# EAGLE schematic main (EAGLE 5.01)
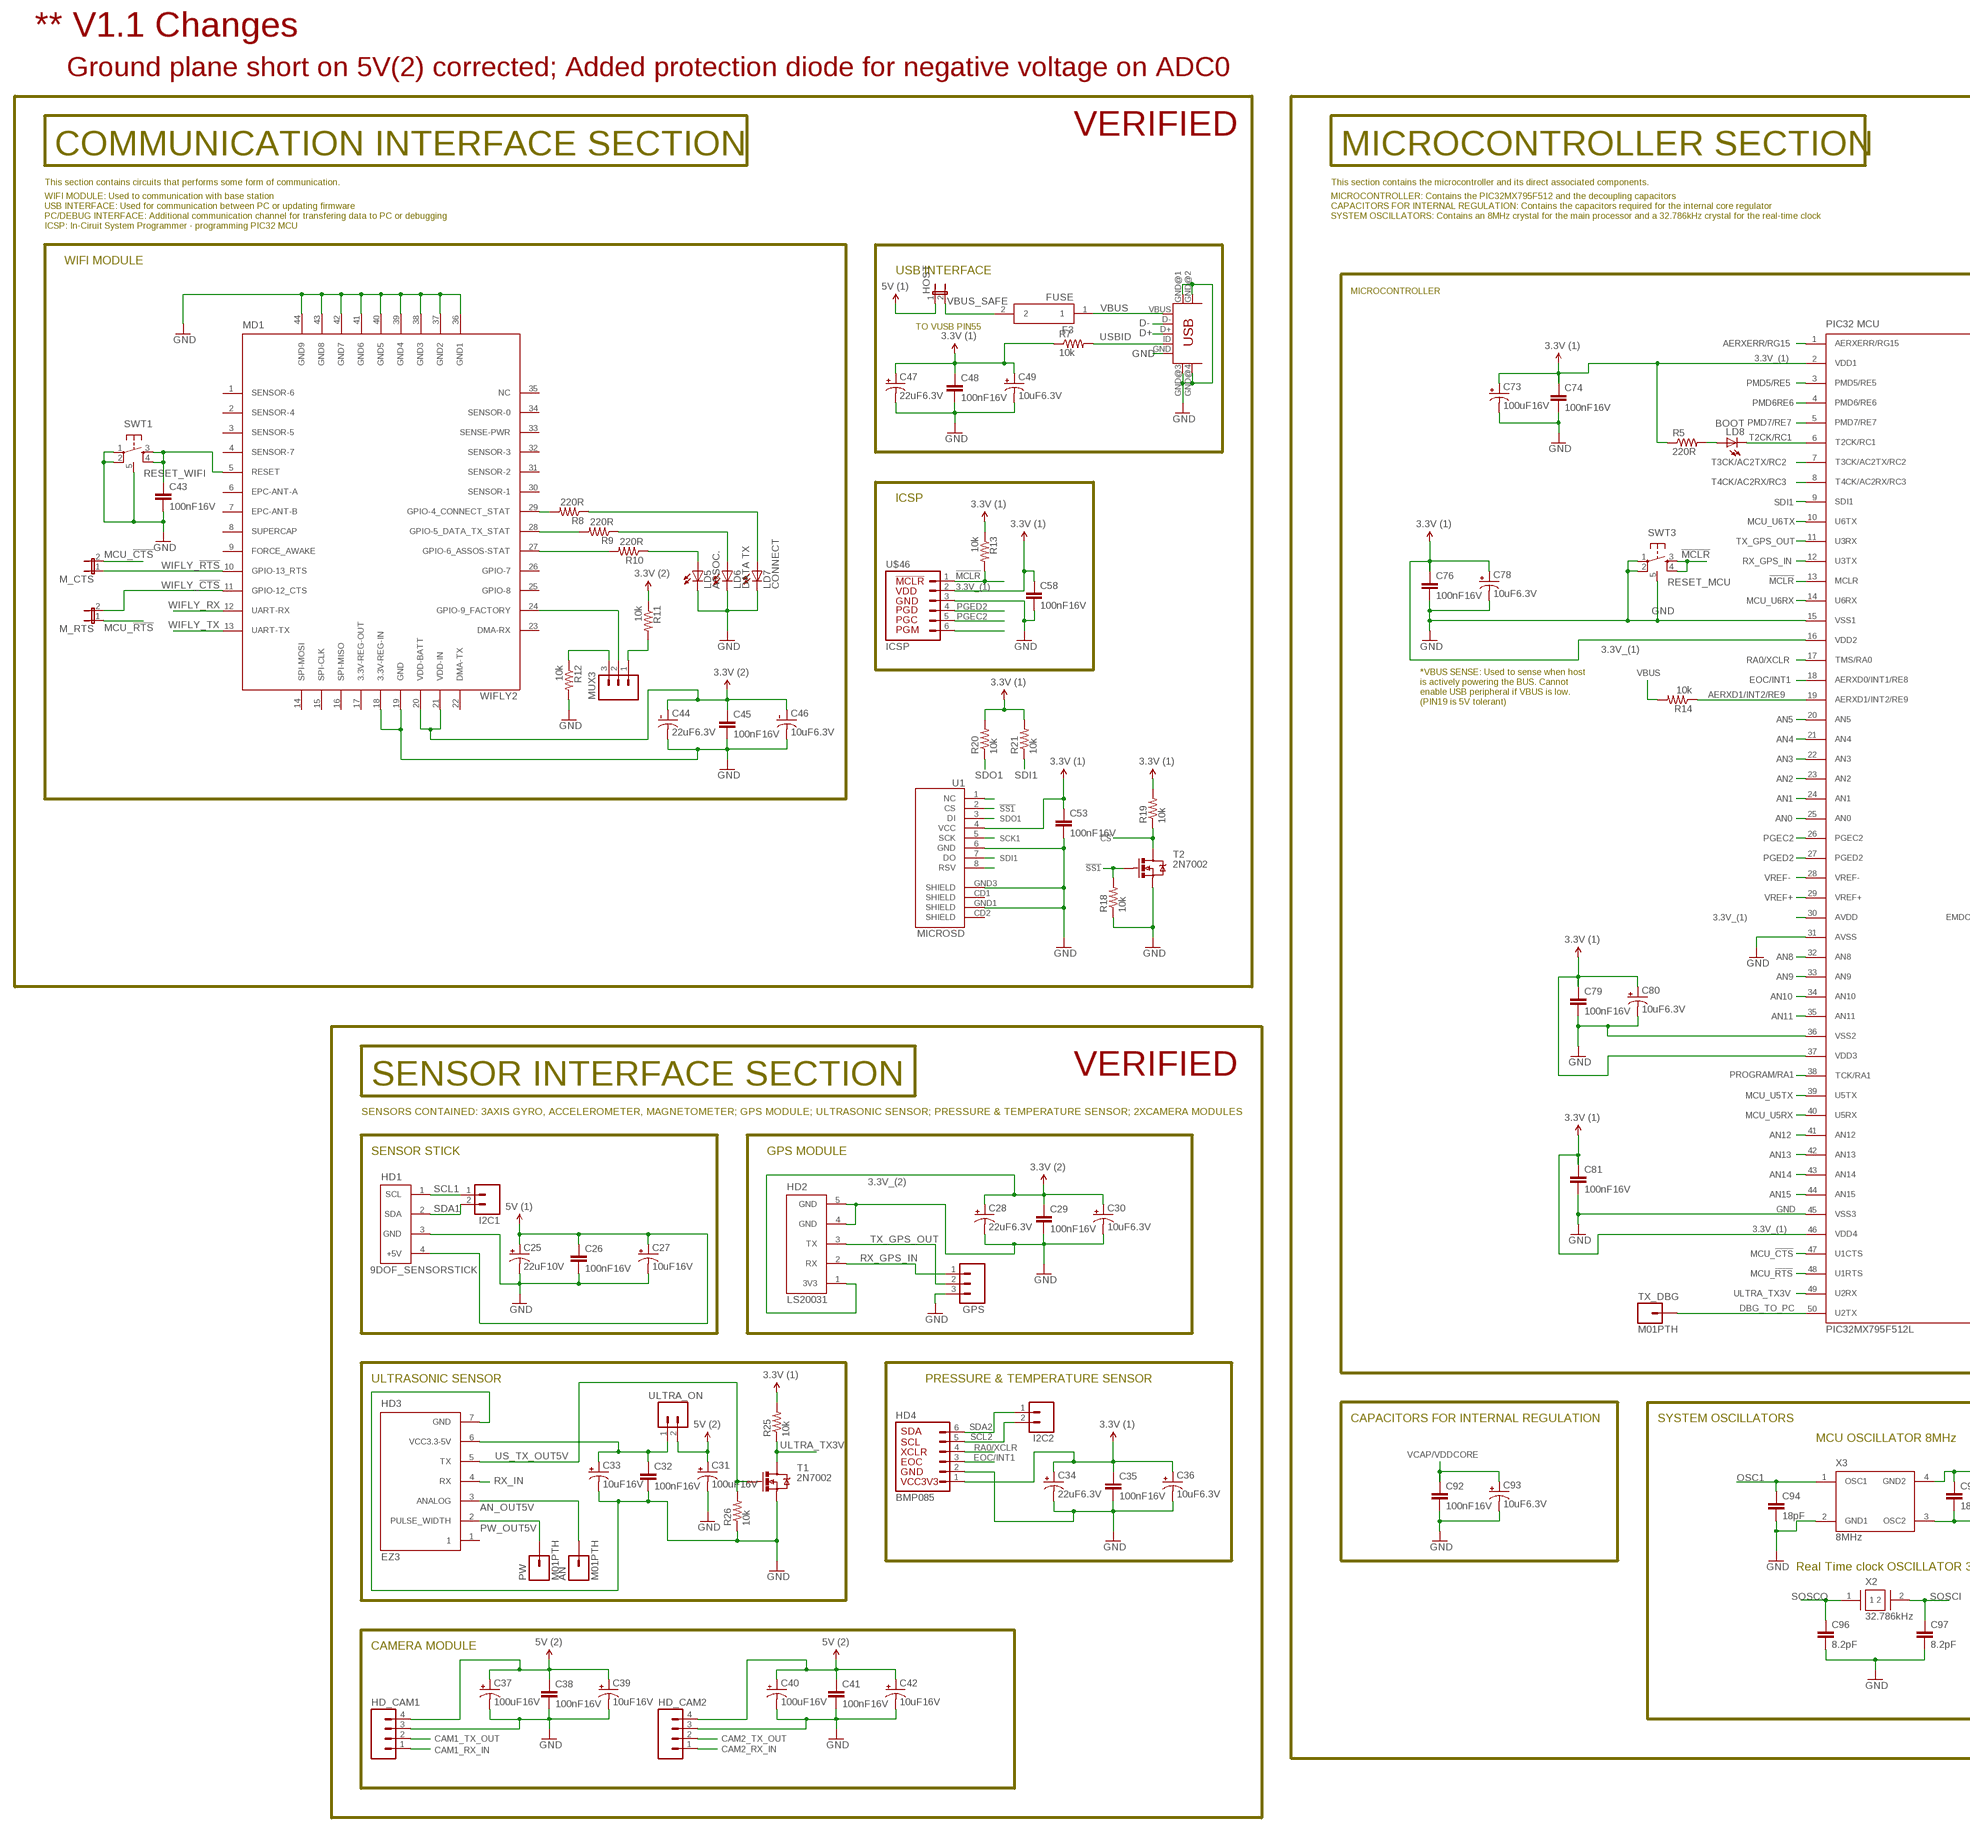
[diagram p0: schematic, sheet 1, part 1 of 2]
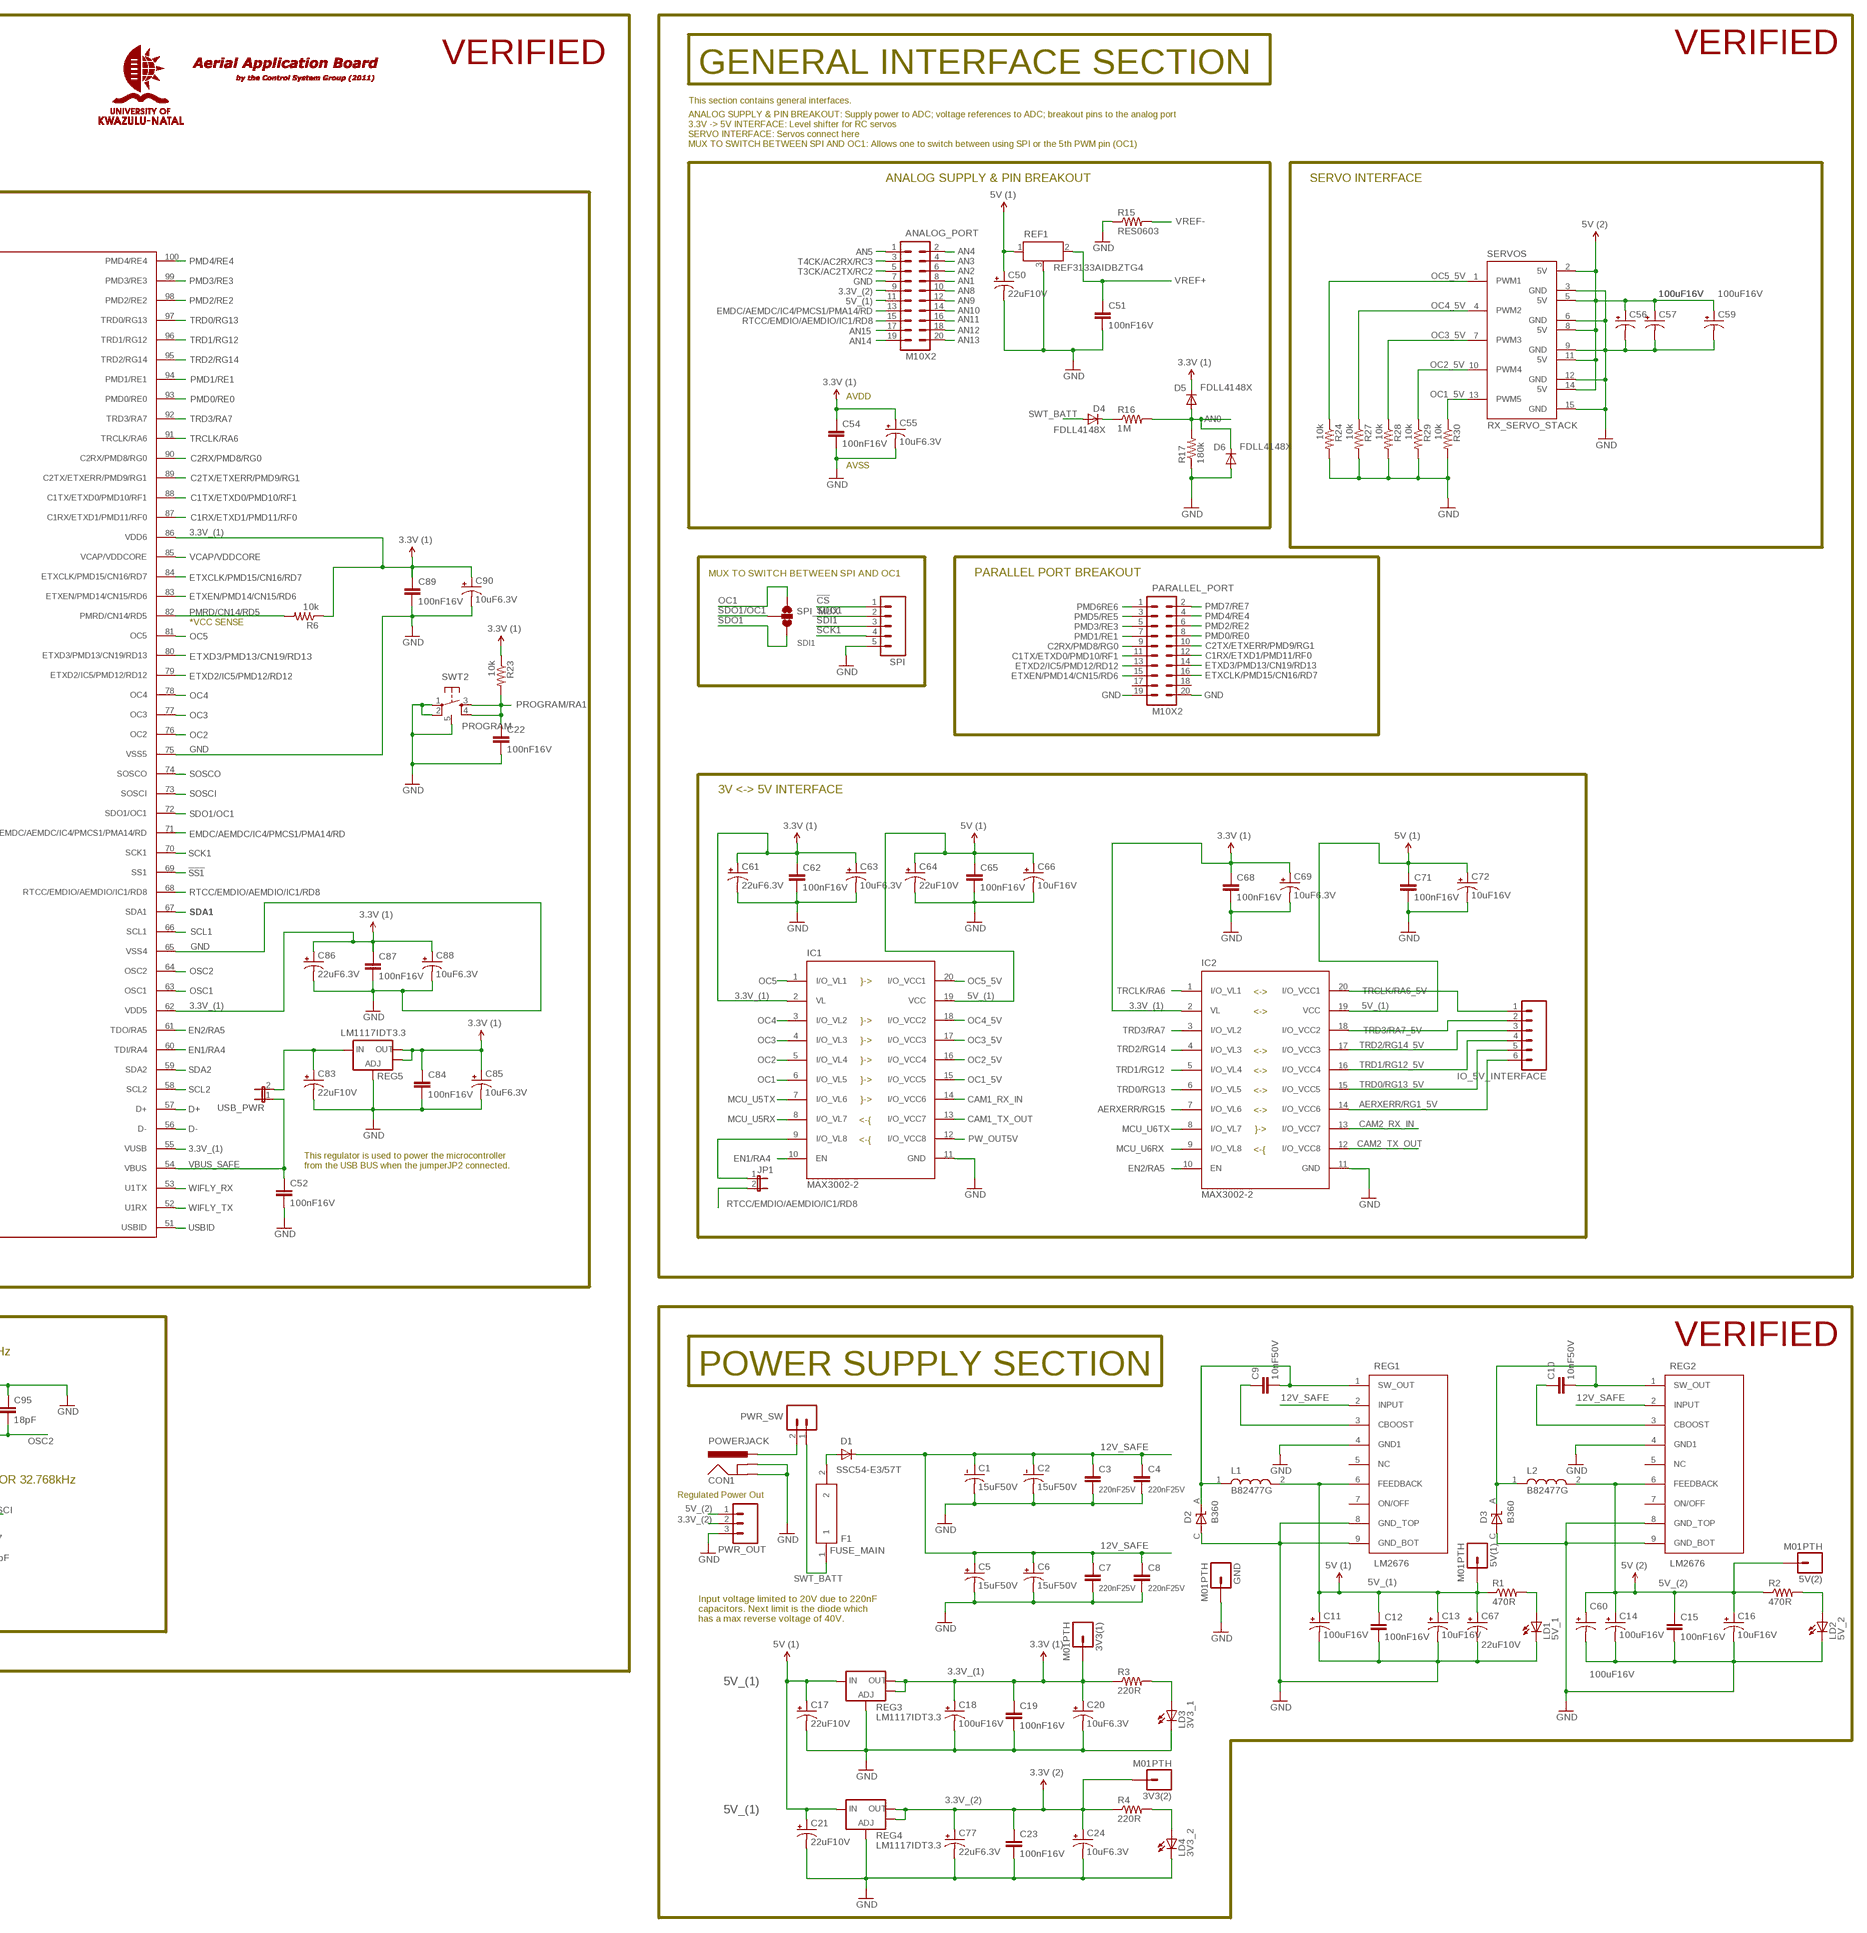
[diagram p1: schematic, sheet 1, part 2 of 2]

## Parts
3V3(1)  M01PTH  [1X01]
3V3(2)  M01PTH  [1X01]
5V(1)  M01PTH  [1X01]
5V(2)  M01PTH  [1X01]
AN  M01PTH  [1X01]
ANALOG_PORT  M10X2  [2X10]
C1  15uF50V  NAZT150M50V6.3X6.3NBF  [NAZT150M50V6.3X6.3NBF]
C2  15uF50V  CAP100UF16V  [6.3X5.5]
C3  220nF25V  CAP_0603_CER  [0603]
C4  220nF25V  CAP_0603_CER  [0603]
C5  15uF50V  NAZT150M50V6.3X6.3NBF  [NAZT150M50V6.3X6.3NBF]
C6  15uF50V  CAP100UF16V  [6.3X5.5]
C7  220nF25V  CAP_0603_CER  [0603]
C8  220nF25V  CAP_0603_CER  [0603]
C9  10nF50V  CAP_0603_CER  [0603]
C10  10nF50V  CAP_0603_CER  [0603]
C11  100uF16V  CAP100UF16V  [6.3X5.5]
C12  100nF16V  CAP_0603_CER  [0603]
C13  10uF16V  CAP_POL_TANT3216  [EIA3216-18]
C14  100uF16V  CAP100UF16V  [6.3X5.5]
C15  100nF16V  CAP_0603_CER  [0603]
C16  10uF16V  CAP_POL_TANT3216  [EIA3216-18]
C17  22uF10V  CAP4X6.3MM  [4X6.3]
C18  100uF16V  CAP100UF16V  [6.3X5.5]
C19  100nF16V  CAP_0603_CER  [0603]
C20  10uF6.3V  CAP_POL_TANT3216  [EIA3216-18]
C21  22uF10V  CAP4X6.3MM  [4X6.3]
C22  100nF16V  CAP_0603_CER  [0603]
C23  100nF16V  CAP_0603_CER  [0603]
C24  10uF6.3V  CAP_POL_TANT3216  [EIA3216-18]
C25  22uF10V  CAP4X6.3MM  [4X6.3]
C26  100nF16V  CAP_0603_CER  [0603]
C27  10uF16V  CAP_POL_TANT3216  [EIA3216-18]
C28  22uF6.3V  CAP4X6.3MM  [4X6.3]
C29  100nF16V  CAP_0603_CER  [0603]
C30  10uF6.3V  CAP_POL_TANT3216  [EIA3216-18]
C31  100uF16V  CAP100UF16V  [6.3X5.5]
C32  100nF16V  CAP_0603_CER  [0603]
C33  10uF16V  CAP_POL_TANT3216  [EIA3216-18]
C34  22uF6.3V  CAP4X6.3MM  [4X6.3]
C35  100nF16V  CAP_0603_CER  [0603]
C36  10uF6.3V  CAP_POL_TANT3216  [EIA3216-18]
C37  100uF16V  CAP100UF16V  [6.3X5.5]
C38  100nF16V  CAP_0603_CER  [0603]
C39  10uF16V  CAP_POL_TANT3216  [EIA3216-18]
C40  100uF16V  CAP100UF16V  [6.3X5.5]
C41  100nF16V  CAP_0603_CER  [0603]
C42  10uF16V  CAP_POL_TANT3216  [EIA3216-18]
C43  100nF16V  CAP_0603_CER  [0603]
C44  22uF6.3V  CAP4X6.3MM  [4X6.3]
C45  100nF16V  CAP_0603_CER  [0603]
C46  10uF6.3V  CAP_POL_TANT3216  [EIA3216-18]
C47  22uF6.3V  CAP4X6.3MM  [4X6.3]
C48  100nF16V  CAP_0603_CER  [0603]
C49  10uF6.3V  CAP_POL_TANT3216  [EIA3216-18]
C50  22uF10V  CAP4X6.3MM  [4X6.3]
C51  100nF16V  CAP_0603_CER  [0603]
C52  100nF16V  CAP_0603_CER  [0603]
C53  100nF16V  CAP_0603_CER  [0603]
C54  100nF16V  CAP_0603_CER  [0603]
C55  10uF6.3V  CAP_POL_TANT3216  [EIA3216-18]
C56  100uF16V  CAP100UF16V  [6.3X5.5]
C57  100uF16V  CAP100UF16V  [6.3X5.5]
C58  100nF16V  CAP_0603_CER  [0603]
C59  100uF16V  CAP100UF16V  [6.3X5.5]
C60  100uF16V  CAP100UF16V  [6.3X5.5]
C61  22uF6.3V  CAP4X6.3MM  [4X6.3]
C62  100nF16V  CAP_0603_CER  [0603]
C63  10uF6.3V  CAP_POL_TANT3216  [EIA3216-18]
C64  22uF10V  CAP4X6.3MM  [4X6.3]
C65  100nF16V  CAP_0603_CER  [0603]
C66  10uF16V  CAP_POL_TANT3216  [EIA3216-18]
C67  22uF10V  CAP4X6.3MM  [4X6.3]
C68  100nF16V  CAP_0603_CER  [0603]
C69  10uF6.3V  CAP_POL_TANT3216  [EIA3216-18]
C71  100nF16V  CAP_0603_CER  [0603]
C72  10uF16V  CAP_POL_TANT3216  [EIA3216-18]
C73  100uF16V  CAP100UF16V  [6.3X5.5]
C74  100nF16V  CAP_0603_CER  [0603]
C76  100nF16V  CAP_0603_CER  [0603]
C77  22uF6.3V  CAP4X6.3MM  [4X6.3]
C78  10uF6.3V  CAP_POL_TANT3216  [EIA3216-18]
C79  100nF16V  CAP_0603_CER  [0603]
C80  10uF6.3V  CAP_POL_TANT3216  [EIA3216-18]
C81  100nF16V  CAP_0603_CER  [0603]
C83  22uF10V  CAP4X6.3MM  [4X6.3]
C84  100nF16V  CAP_0603_CER  [0603]
C85  10uF6.3V  CAP_POL_TANT3216  [EIA3216-18]
C86  22uF6.3V  CAP4X6.3MM  [4X6.3]
C87  100nF16V  CAP_0603_CER  [0603]
C88  10uF6.3V  CAP_POL_TANT3216  [EIA3216-18]
C89  100nF16V  CAP_0603_CER  [0603]
C90  10uF6.3V  CAP_POL_TANT3216  [EIA3216-18]
C92  100nF16V  CAP_0603_CER  [0603]
C93  10uF6.3V  CAP_POL_TANT3216  [EIA3216-18]
C94  18pF  CAP_0603_CER  [0603]
C95  18pF  CAP_0603_CER  [0603]
C96  8.2pF  CAP_0603_CER  [0603]
C97  8.2pF  CAP_0603_CER  [0603]
CON1  POWERJACK  [POWERJACK]
D1  SSC54-E3/57T  [DO-214AB(SMC)]
D2  B360  [SMC]
D3  B360  [SMC]
D4  FDLL4148X  D-MLL-34  [MELF-MLL34]
D5  FDLL4148X  D-MLL-34  [MELF-MLL34]
D6  FDLL4148X  D-MLL-34  [MELF-MLL34]
F1  FUSE_MAIN  [3413.0223.22]
F3  FUSE  [MF-MSMF020-2]
GND  M01PTH  [1X01]
GPS  M03PTH  [1X03]
HD1  9DOF_SENSORSTICK  [SENSOR_STICK]
HD2  LS20031  [LS20031]
HD3  EZ3  [EZ3]
HD4  BMP085  BAROMETER  [BAROMETER]
HD_CAM1  M04PTH  [1X04]
HD_CAM2  M04PTH  [1X04]
HOST  JUMPER-2SMD-NO  [SJ_2S-NO]
I2C1  M02PTH  [1X02]
I2C2  M02PTH  [1X02]
IC1  MAX3002-2  [U20-3]
IC2  MAX3002-2  [U20-3]
IO_5V_INTERFACE  M06SIP  [1X06]
JP1  JUMPER-2SMD-NO  [SJ_2S-NO]
L1  B82477G  [12X12MM_PACK]
L2  B82477G  [12X12MM_PACK]
LD1  5V_1  LEDCHIPLED_0603  [CHIPLED_0603]
LD2  5V_2  LEDCHIPLED_0603  [CHIPLED_0603]
LD3  3V3_1  LEDCHIPLED_0603  [CHIPLED_0603]
LD4  3V3_2  LEDCHIPLED_0603  [CHIPLED_0603]
LD5  ASSOC.  LEDCHIPLED_0603  [CHIPLED_0603]
LD6  DATA TX  LEDCHIPLED_0603  [CHIPLED_0603]
LD7  CONNECT  LEDCHIPLED_0603  [CHIPLED_0603]
LD8  BOOT  LEDCHIPLED_0603  [CHIPLED_0603]
M_CTS  JUMPER-2SMD-NO  [SJ_2S-NO]
M_RTS  JUMPER-2SMD-NO  [SJ_2S-NO]
MCU  PIC32MX795F512L  [TQFP100_12MM]
MD1  WIFLY2  [WIFIFLY2]
MUX3  M03PTH  [1X03]
PARALLEL_PORT  M10X2  [2X10]
PW  M01PTH  [1X01]
PWR_OUT  M03-SCREW-5MM  [SCREWTERMINAL-5MM-3]
PWR_SW  M025MM  [SCREWTERMINAL-5MM-2]
R1  470R  RES0603  [0603]
R2  470R  RES0603  [0603]
R3  220R  RES0603  [0603]
R4  220R  RES0603  [0603]
R5  220R  RES0603  [0603]
R6  10k  RES0603  [0603]
R7  10k  RES0603  [0603]
R8  220R  RES0603  [0603]
R9  220R  RES0603  [0603]
R10  220R  RES0603  [0603]
R11  10k  RES0603  [0603]
R12  10k  RES0603  [0603]
R13  10k  RES0603  [0603]
R14  10k  RES0603  [0603]
R15  RES0603  [0603]
R16  1M  RES0603  [0603]
R17  180k  RES0603  [0603]
R18  10k  RES0603  [0603]
R19  10k  RES0603  [0603]
R20  10k  RES0603  [0603]
R21  10k  RES0603  [0603]
R23  10k  RES0603  [0603]
R24  10k  RES0603  [0603]
R25  10k  RES0603  [0603]
R26  10k  RES0603  [0603]
R27  10k  RES0603  [0603]
R28  10k  RES0603  [0603]
R29  10k  RES0603  [0603]
R30  10k  RES0603  [0603]
REF1  REF3133AIDBZTG4  [SOT-23-3]
REG1  LM2676  [TO-263]
REG2  LM2676  [TO-263]
REG3  LM1117IDT3.3  V_REG_LM1117SOT223  [SOT223]
REG4  LM1117IDT3.3  V_REG_LM1117SOT223  [SOT223]
REG5  LM1117IDT3.3  V_REG_LM1117SOT223  [SOT223]
SERVOS  RX_SERVO_STACK  [SERVO_HEADER]
SPI  M05PTH  [1X05]
SPI_MUX  SOLDERJUMPER_2WAYS  [SJ_3]
SWT1  RESET_WIFI  TACT  [TACT]
SWT2  PROGRAM  TACT  [TACT]
SWT3  RESET_MCU  TACT  [TACT]
T1  2N7002  MOSFET  [MOSFET]
T2  2N7002  MOSFET  [MOSFET]
TX_DBG  M01PTH  [1X01]
U1  MICROSD  USD-SOCKETNEW  [MICRO-SD-SOCKET-PP]
U$46  ICSP  [ICSP]
U$47  USBMINIB2  [USBMINIB2]
ULTRA_ON  M02PTH  [1X02]
USB_PWR  JUMPER-2SMD-NO  [SJ_2S-NO]
X2  32.786kHz  2PIN_RTCC  [1.5X3.2MM_SMD_RTCC]
X3  8MHz  SMD_4PIN_OSC  [3.2X5MM_SMD_CRYSTAL]

## Nets
3.3V_(1): 3V3(1).1 C18.+ C19.1 C20.C(+) C34.C(+) C35.1 C36.C(+) C47.C(+) C48.1 C49.C(+) C53.1 C54.1 C55.C(+) C58.1 C61.C(+) C62.1 C63.C(+) C68.1 C69.C(+) C73.+ C74.1 C76.1 C78.C(+) C79.1 C80.C(+) C81.1 C84.1 C85.C(+) C86.C(+) C87.1 C88.C(+) C89.1 C90.C(+) D5.1(C) HD4.1 IC1.2(VL) IC2.2(VL) MCU.2(VDD1) MCU.16(VDD2) MCU.30(AVDD) MCU.37(VDD3) MCU.46(VDD4) MCU.55(VUSB) MCU.62(VDD5) MCU.86(VDD6) R3.2 R5.2 R6.2 R7.2 R13.2 R19.1 R20.1 R21.1 R23.2 R25.1 REG3.2(OUT) REG3.4(OUT) REG5.2(OUT) REG5.4(OUT) U1.4(VCC) U$46.2(VDD) ; supply symbol labelled 3.3V(1)
3.3V_(2): 3V3(2).1 ANALOG_PORT.9 C23.1 C24.C(+) C28.C(+) C29.1 C30.C(+) C44.C(+) C45.1 C46.C(+) C77.C(+) HD2.1(3V3) MD1.20(VDD-BATT) MD1.21(VDD-IN) PWR_OUT.2 R4.2 R11.2 REG4.2(OUT) REG4.4(OUT) ; supply symbol labelled 3.3V(2)
5V_(1): 5V(1).1 ANALOG_PORT.11 C11.+ C12.1 C13.C(+) C17.C(+) C21.C(+) C25.C(+) C26.1 C27.C(+) C50.C(+) C64.C(+) C65.1 C66.C(+) C67.C(+) C71.1 C72.C(+) HD1.4(+5V) HOST.1 IC1.19(VCC) IC2.19(VCC) L1.2 R1.2 REF1.1(VIN) REG1.6(FEEDBACK) REG3.3(IN) REG4.3(IN) ; supply symbol labelled 5V(1)
5V_(2): 5V(2).1 C14.+ C15.1 C16.C(+) C31.+ C37.+ C38.1 C39.C(+) C40.+ C41.1 C42.C(+) C56.+ C57.+ C59.+ C60.+ HD_CAM1.4 HD_CAM2.4 L2.2 PWR_OUT.1 R2.2 REG2.6(FEEDBACK) SERVOS.2(5V) SERVOS.5(5V) SERVOS.8(5V) SERVOS.11(5V) SERVOS.14(5V) ULTRA_ON.2 ; supply symbol labelled 5V(2)
12V_SAFE: C1.+ C2.+ C3.1 C4.1 C5.+ C6.+ C7.1 C8.1 D1.A REG1.2(INPUT) REG2.2(INPUT)
!CS: R19.2 SPI.1 T2.3(D)
!MCLR: MCU.13(MCLR) R13.1 SWT3.3 SWT3.4 U$46.1(!MCLR)
!SS1: MCU.69(SS1) R18.1 T2.1(G) U1.2(CS)
AERXD1/INT2/RE9: MCU.19(AERXD1/INT2/RE9) R14.2
AERXERR/RG1_5V: IC2.14(I/O_VCC6) IO_5V_INTERFACE.6
AERXERR/RG15: IC2.7(I/O_VL6) MCU.1(AERXERR/RG15)
AN0: D5.2(A) D6.1(C) MCU.25(AN0) R16.1 R17.1
AN1: ANALOG_PORT.8 MCU.24(AN1)
AN2: ANALOG_PORT.6 MCU.23(AN2)
AN3: ANALOG_PORT.4 MCU.22(AN3)
AN4: ANALOG_PORT.2 MCU.21(AN4)
AN5: ANALOG_PORT.1 MCU.20(AN5)
AN8: ANALOG_PORT.10 MCU.32(AN8)
AN9: ANALOG_PORT.12 MCU.33(AN9)
AN10: ANALOG_PORT.14 MCU.34(AN10)
AN11: ANALOG_PORT.16 MCU.35(AN11)
AN12: ANALOG_PORT.18 MCU.41(AN12)
AN13: ANALOG_PORT.20 MCU.42(AN13)
AN14: ANALOG_PORT.19 MCU.43(AN14)
AN15: ANALOG_PORT.17 MCU.44(AN15)
AN_OUT5V: AN.1 HD3.3(ANALOG)
C1RX/ETXD1/PMD11/RF0: MCU.87(C1RX/ETXD1/PMD11/RF0) PARALLEL_PORT.12
C1TX/ETXD0/PMD10/RF1: MCU.88(C1TX/ETXD0/PMD10/RF1) PARALLEL_PORT.11
C2RX/PMD8/RG0: MCU.90(C2RX/PMD8/RG0) PARALLEL_PORT.9
C2TX/ETXERR/PMD9/RG1: MCU.89(C2TX/ETXERR/PMD9/RG1) PARALLEL_PORT.10
CAM1_RX_IN: HD_CAM1.1 IC1.14(I/O_VCC6)
CAM1_TX_OUT: HD_CAM1.2 IC1.13(I/O_VCC7)
CAM2_RX_IN: HD_CAM2.1 IC2.13(I/O_VCC7)
CAM2_TX_OUT: HD_CAM2.2 IC2.12(I/O_VCC8)
CX9: C9.2 D2.A L1.1 REG1.1(SW_OUT)
CX10: C10.2 D3.A L2.1 REG2.1(SW_OUT)
D+: MCU.57(D+) U$47.D+
D-: MCU.56(D-) U$47.D-
DBG_TO_PC: MCU.50(U2TX) TX_DBG.1
EMDC/AEMDC/IC4/PMCS1/PMA14/RD: ANALOG_PORT.13 MCU.71(EMDC/AEMDC/IC4/PMCS1/PMA14/RD)
EN1/RA4: IC1.10(EN) MCU.60(TDI/RA4)
EN2/RA5: IC2.10(EN) MCU.61(TDO/RA5)
EOC/INT1: HD4.3 MCU.18(AERXD0/INT1/RE8)
ETXCLK/PMD15/CN16/RD7: MCU.84(ETXCLK/PMD15/CN16/RD7) PARALLEL_PORT.16
ETXD2/IC5/PMD12/RD12: MCU.79(ETXD2/IC5/PMD12/RD12) PARALLEL_PORT.13
ETXD3/PMD13/CN19/RD13: MCU.80(ETXD3/PMD13/CN19/RD13) PARALLEL_PORT.14
ETXEN/PMD14/CN15/RD6: MCU.83(ETXEN/PMD14/CN15/RD6) PARALLEL_PORT.15
GND: ANALOG_PORT.7 C1.- C2.- C3.2 C4.2 C5.- C6.- C7.2 C8.2 C11.- C12.2 C13.A(-) C14.- C15.2 C16.A(-) C17.A(-) C18.- C19.2 C20.A(-) C21.A(-) C22.2 C23.2 C24.A(-) C25.A(-) C26.2 C27.A(-) C28.A(-) C29.2 C30.A(-) C31.- C32.2 C33.A(-) C34.A(-) C35.2 C36.A(-) C37.- C38.2 C39.A(-) C40.- C41.2 C42.A(-) C43.2 C44.A(-) C45.2 C46.A(-) C47.A(-) C48.2 C49.A(-) C50.A(-) C51.2 C52.2 C53.2 C54.2 C55.A(-) C56.- C57.- C58.2 C59.- C60.- C61.A(-) C62.2 C63.A(-) C64.A(-) C65.2 C66.A(-) C67.A(-) C68.2 C69.A(-) C71.2 C72.A(-) C73.- C74.2 C76.2 C77.A(-) C78.A(-) C79.2 C80.A(-) C81.2 C83.A(-) C84.2 C85.A(-) C86.A(-) C87.2 C88.A(-) C89.2 C90.A(-) C92.2 C93.A(-) C94.2 C95.1 C96.2 C97.2 CON1.P$2(GND) CON1.P$3(GNDBREAK) D2.C D3.C D6.2(A) GND.1 GPS.3 HD1.3(GND) HD2.4(GND) HD2.5(GND) HD3.7(GND) HD4.2 HD_CAM1.3 HD_CAM2.3 IC1.11(GND) IC2.11(GND) LD1.C LD2.C LD3.C LD4.C LD5.C LD6.C LD7.C MCU.15(VSS1) MCU.31(AVSS) MCU.36(VSS2) MCU.45(VSS3) MCU.65(VSS4) MCU.75(VSS5) MD1.18(3.3V-REG-IN) MD1.19(GND) MD1.36(GND1) MD1.37(GND2) MD1.38(GND3) MD1.39(GND4) MD1.40(GND5) MD1.41(GND6) MD1.42(GND7) MD1.43(GND8) MD1.44(GND9) PARALLEL_PORT.19 PARALLEL_PORT.20 PWR_OUT.3 R12.1 R15.2 R17.2 R18.2 R24.1 R26.2 R27.1 R28.1 R29.1 R30.1 REF1.3(GND) REG1.4(GND1) REG1.8(GND_TOP) REG1.9(GND_BOT) REG2.4(GND1) REG2.8(GND_TOP) REG2.9(GND_BOT) REG3.1(ADJ) REG4.1(ADJ) REG5.1(ADJ) SERVOS.3(GND) SERVOS.6(GND) SERVOS.9(GND) SERVOS.12(GND) SERVOS.15(GND) SPI.5 SWT1.1 SWT1.2 SWT1.5(GND) SWT2.1 SWT2.2 SWT2.5(GND) SWT3.1 SWT3.2 SWT3.5(GND) T1.2(S) T2.2(S) U1.6(GND) U1.GND1(SHIELD) U1.GND3(SHIELD) U$46.3(GND) U$47.GND U$47.GND@1(GND) U$47.GND@2(GND) U$47.GND@3(GND) U$47.GND@4(GND) X3.2(GND1) X3.4(GND2)
L2: C10.1 REG2.3(CBOOST)
MCU_!CTS: M_CTS.2 MCU.47(U1CTS)
MCU_!RTS: M_RTS.1 MCU.48(U1RTS)
MCU_U5RX: IC1.8(I/O_VL7) MCU.40(U5RX)
MCU_U5TX: IC1.7(I/O_VL6) MCU.39(U5TX)
MCU_U6RX: IC2.9(I/O_VL8) MCU.14(U6RX)
MCU_U6TX: IC2.8(I/O_VL7) MCU.10(U6TX)
N$1: IC1.9(I/O_VL8) JP1.1
N$3: LD1.A R1.1
N$6: U1.1(NC)
N$7: LD2.A R2.1
N$8: C9.1 REG1.3(CBOOST)
N$9: LD3.A R3.1
N$10: LD4.A R4.1
N$11: CON1.P$1(PWR) PWR_SW.2
N$12: C83.C(+) REG5.3(IN) USB_PWR.2
N$13: LD8.A R5.1
N$14: C43.1 MD1.5(RESET) SWT1.3 SWT1.4
N$15: C32.1 C33.C(+) HD3.6(VCC3.3-5V) ULTRA_ON.1
N$16: D1.C F1.2
N$18: MD1.24(GPIO-9_FACTORY) MUX3.2
N$19: MUX3.1 R11.1
N$20: MD1.29(GPIO-4_CONNECT_STAT) R8.1
N$21: LD7.A R8.2
N$22: MD1.28(GPIO-5_DATA_TX_STAT) R9.1
N$23: LD6.A R9.2
N$24: MD1.27(GPIO-6_ASSOS-STAT) R10.1
N$25: LD5.A R10.2
N$26: MUX3.3 R12.2
N$31: D4.1(C) R16.2
N$32: U1.8(RSV)
N$35: U$46.6(PGM)
OC1: IC1.6(I/O_VL5) SPI_MUX.1
OC1_5V: IC1.15(I/O_VCC5) R30.2 SERVOS.13(PWM5)
OC2: IC1.5(I/O_VL4) MCU.76(OC2)
OC2_5V: IC1.16(I/O_VCC4) R29.2 SERVOS.10(PWM4)
OC3: IC1.4(I/O_VL3) MCU.77(OC3)
OC3_5V: IC1.17(I/O_VCC3) R28.2 SERVOS.7(PWM3)
OC4: IC1.3(I/O_VL2) MCU.78(OC4)
OC4_5V: IC1.18(I/O_VCC2) R27.2 SERVOS.4(PWM2)
OC5: IC1.1(I/O_VL1) MCU.81(OC5)
OC5_5V: IC1.20(I/O_VCC1) R24.2 SERVOS.1(PWM1)
OSC1: C94.1 MCU.63(OSC1) X3.1(OSC1)
OSC2: C95.2 MCU.64(OSC2) X3.3(OSC2)
PGEC2: MCU.26(PGEC2) U$46.5(PGC)
PGED2: MCU.27(PGED2) U$46.4(PGD)
PMD0/RE0: MCU.93(PMD0/RE0) PARALLEL_PORT.8
PMD1/RE1: MCU.94(PMD1/RE1) PARALLEL_PORT.7
PMD2/RE2: MCU.98(PMD2/RE2) PARALLEL_PORT.6
PMD3/RE3: MCU.99(PMD3/RE3) PARALLEL_PORT.5
PMD4/RE4: MCU.100(PMD4/RE4) PARALLEL_PORT.4
PMD5/RE5: MCU.3(PMD5/RE5) PARALLEL_PORT.3
PMD6RE6: MCU.4(PMD6/RE6) PARALLEL_PORT.1
PMD7/RE7: MCU.5(PMD7/RE7) PARALLEL_PORT.2
PMRD/CN14/RD5: MCU.82(PMRD/CN14/RD5) R6.1
PROGRAM/RA1: C22.1 MCU.38(TCK/RA1) R23.1 SWT2.3 SWT2.4
PW_OUT5V: HD3.2(PULSE_WIDTH) IC1.12(I/O_VCC8) PW.1
RA0/XCLR: HD4.4 MCU.17(TMS/RA0)
RTCC/EMDIO/AEMDIO/IC1/RD8: ANALOG_PORT.15 JP1.2 MCU.68(RTCC/EMDIO/AEMDIO/IC1/RD8)
RX_GPS_IN: GPS.1 HD2.2(RX) MCU.12(U3TX)
RX_IN: HD3.4(RX)
SCK1: MCU.70(SCK1) SPI.4 U1.5(SCK)
SCL1: HD1.1(SCL) I2C1.1 MCU.66(SCL1)
SCL2: HD4.5 I2C2.2 MCU.58(SCL2)
SDA1: HD1.2(SDA) I2C1.2 MCU.67(SDA1)
SDA2: HD4.6 I2C2.1 MCU.59(SDA2)
SDI1: MCU.9(SDI1) R21.2 SPI.3 U1.7(DO)
SDO1: R20.2 SPI.2 SPI_MUX.3 U1.3(DI)
SDO1/OC1: MCU.72(SDO1/OC1) SPI_MUX.2
SOSCI: C97.1 MCU.73(SOSCI) X2.2
SOSCO: C96.1 MCU.74(SOSCO) X2.1
SWT_BATT: D4.2(A) F1.1 PWR_SW.1
T2CK/RC1: LD8.C MCU.6(T2CK/RC1)
T3CK/AC2TX/RC2: ANALOG_PORT.5 MCU.7(T3CK/AC2TX/RC2)
T4CK/AC2RX/RC3: ANALOG_PORT.3 MCU.8(T4CK/AC2RX/RC3)
TRCLK/RA6: IC2.1(I/O_VL1) MCU.91(TRCLK/RA6)
TRCLK/RA6_5V: IC2.20(I/O_VCC1) IO_5V_INTERFACE.1
TRD0/RG13: IC2.6(I/O_VL5) MCU.97(TRD0/RG13)
TRD0/RG13_5V: IC2.15(I/O_VCC5) IO_5V_INTERFACE.5
TRD1/RG12: IC2.5(I/O_VL4) MCU.96(TRD1/RG12)
TRD1/RG12_5V: IC2.16(I/O_VCC4) IO_5V_INTERFACE.4
TRD2/RG14: IC2.4(I/O_VL3) MCU.95(TRD2/RG14)
TRD2/RG14_5V: IC2.17(I/O_VCC3) IO_5V_INTERFACE.3
TRD3/RA7: IC2.3(I/O_VL2) MCU.92(TRD3/RA7)
TRD3/RA7_5V: IC2.18(I/O_VCC2) IO_5V_INTERFACE.2
TX_GPS_OUT: GPS.2 HD2.3(TX) MCU.11(U3RX)
ULTRA_TX3V: MCU.49(U2RX) R25.2 T1.3(D)
US_TX_OUT5V: HD3.5(TX) R26.1 T1.1(G)
USBID: MCU.51(USBID) R7.1 U$47.ID
VBUS: F3.1 R14.1 U$47.VBUS
VBUS_SAFE: C52.1 F3.2 HOST.2 MCU.54(VBUS) USB_PWR.1
VCAP/VDDCORE: C92.1 C93.C(+) MCU.85(VCAP/VDDCORE)
VREF+: C51.1 MCU.29(VREF+) REF1.2(OUT)
VREF-: MCU.28(VREF-) R15.1
WIFLY_!CTS: M_RTS.2 MD1.11(GPIO-12_CTS)
WIFLY_!RTS: M_CTS.1 MD1.10(GPIO-13_RTS)
WIFLY_RX: MCU.53(U1TX) MD1.12(UART-RX)
WIFLY_TX: MCU.52(U1RX) MD1.13(UART-TX)
Unconnected: HD3.1 MD1.1(SENSOR-6) MD1.2(SENSOR-4) MD1.3(SENSOR-5) MD1.4(SENSOR-7) MD1.6(EPC-ANT-A) MD1.7(EPC-ANT-B) MD1.8(SUPERCAP) MD1.9(FORCE_AWAKE) MD1.14(SPI-MOSI) MD1.15(SPI-CLK) MD1.16(SPI-MISO) MD1.17(3.3V-REG-OUT) MD1.22(DMA-TX) MD1.23(DMA-RX) MD1.25(GPIO-8) MD1.26(GPIO-7) MD1.30(SENSOR-1) MD1.31(SENSOR-2) MD1.32(SENSOR-3) MD1.33(SENSE-PWR) MD1.34(SENSOR-0) MD1.35(NC) PARALLEL_PORT.17 PARALLEL_PORT.18 REG1.5(NC) REG1.7(ON/OFF) REG2.5(NC) REG2.7(ON/OFF) U1.CD1(SHIELD) U1.CD2(SHIELD)

## Notes on the sheet
- ** V1.1 Changes
- Ground plane short on 5V(2) corrected; Added protection diode for negative voltage on ADC0
- VERIFIED | VERIFIED | VERIFIED
- COMMUNICATION INTERFACE SECTION | MICROCONTROLLER SECTION | GENERAL INTERFACE SECTION
- This section contains circuits that performs some form of communication. | This section contains the microcontroller and its direct associated components. | This section contains general interfaces.
- WIFI MODULE: Used to communication with base station | MICROCONTROLLER: Contains the PIC32MX795F512 and the decoupling capacitors | ANALOG SUPPLY & PIN BREAKOUT: Supply power to ADC; voltage references to ADC; breakout pins to the analog port
- C:/Users/Yashren/Pictures/logo2rgbmono2.bmp
- USB INTERFACE: Used for communication between PC or updating firmware | CAPACITORS FOR INTERNAL REGULATION: Contains the capacitors required for the internal core regulator | 3.3V -> 5V INTERFACE: Level shifter for RC servos
- PC/DEBUG INTERFACE: Additional communication channel for transfering data to PC or debugging | SYSTEM OSCILLATORS: Contains an 8MHz crystal for the main processor and a 32.786kHz crystal for the real-time clock | SERVO INTERFACE: Servos connect here
- ICSP: In-Ciruit System Programmer - programming PIC32 MCU | MUX TO SWITCH BETWEEN SPI AND OC1: Allows one to switch between using SPI or the 5th PWM pin (OC1)
- WIFI MODULE | ANALOG SUPPLY & PIN BREAKOUT | SERVO INTERFACE
- USB INTERFACE
- MICROCONTROLLER
- TO VUSB PIN55
- AVDD
- ICSP
- AVSS
- MUX TO SWITCH BETWEEN SPI AND OC1 | PARALLEL PORT BREAKOUT
- *VBUS SENSE: Used to sense when host
- is actively powering the BUS. Cannot
- enable USB peripheral if VBUS is low.
- (PIN19 is 5V tolerant)
- *VCC SENSE
- 3V <-> 5V INTERFACE
- }->
- VERIFIED
- <->
- SENSOR INTERFACE SECTION
- <->
- }->
- SENSORS CONTAINED: 3AXIS GYRO, ACCELEROMETER, MAGNETOMETER; GPS MODULE; ULTRASONIC SENSOR; PRESSURE & TEMPERATURE SENSOR; 2XCAMERA MODULES
- }->
- <->
- }->
- SENSOR STICK | GPS MODULE
- <->
- }->
- <->
- }->
- <->
- <-{
- }->
- <-{
- <-{
- This regulator is used to power the microcontroller
- from the USB BUS when the jumperJP2 connected.
- ULTRASONIC SENSOR | PRESSURE & TEMPERATURE SENSOR
- CAPACITORS FOR INTERNAL REGULATION | SYSTEM OSCILLATORS
- VERIFIED
- MCU OSCILLATOR 8MHz
- POWER SUPPLY SECTION
- Real Time clock OSCILLATOR 32.768kHz
- Regulated Power Out
- CAMERA MODULE
- Input voltage limited to 20V due to 220nF
- capacitors. Next limit is the diode which
- has a max reverse voltage of 40V.

## Library data of the parts
3V3(1) 3V3(2) 5V(1) 5V(2) AN GND PW TX_DBG = SparkFun:M01: Header 1 Standard 1-pin 0.1" header. Use with straight break away headers (SKU : PRT-00116), right angle break away headers (PRT-00553), swiss pins (PRT-00743), machine pins (PRT-00117), and female headers (PRT-00115).
ANALOG_PORT PARALLEL_PORT = SparkFun:M10X2: This was SPECIALLY designed to be used with our Graphic LCD Backpack. Be sure you want to use this! It is not only staggered on each line of header holes, but IT IS ALSO offset of the center point of the top and bottom lines by 5 mil. This causes the headers to lock into place on the "standard" footprint on the LCD screen. The extra squares on the tdocu layer are there simply to reference other pins (if you were to actually populate a longer header than ten long - this is what we do with the backpacks).
C1 C5 = cap:NAZT150M50V6.3X6.3NBF
C2 C6 C11 C14 C18 C31 C37 C40 C56 C57 C59 C60 C73 = cap:CAP100UF16V
C3 C4 C7-C10 C12 C15 C19 C22 C23 C26 C29 C32 C35 C38 C41 C43 C45 C48 C51-C54 C58 C62 C65 C68 C71 C74 C76 C79 C81 C84 C87 C89 C92 C94-C97 = cap:CAP_0603_CER
C13 C16 C20 C24 C27 C30 C33 C36 C39 C42 C46 C49 C55 C63 C66 C69 C72 C78 C80 C85 C88 C90 C93 = cap:CAP_POL_TANT3216
C17 C21 C25 C28 C34 C44 C47 C50 C61 C64 C67 C77 C83 C86 = cap:CAP4X6.3MM
CON1 = conn:POWERJACK
D1 = diode:SSC54-E3/57T
D2 D3 = diode:B360
D4-D6 = semicon-smd-ipc:D-: DIODE unfilled
F1 = fuse:FUSE_MAIN
F3 = fuse:FUSE
GPS MUX3 PWR_OUT = SparkFun:M03: Header 3 Standard 3-pin 0.1" header. Use with straight break away headers (SKU : PRT-00116), right angle break away headers (PRT-00553), swiss pins (PRT-00743), machine pins (PRT-00117), and female headers (PRT-00115). Molex polarized connector foot print use with SKU : PRT-08232 with associated crimp pins and housings.
HD1 = sensorstick:9DOF_SENSORSTICK
HD2 = gps:LS20031
HD3 = ultrasonic:EZ3
HD4 = barometer:BAROMETER
HD_CAM1 HD_CAM2 = SparkFun:M04: Header 4 Standard 4-pin 0.1" header. Use with straight break away headers (SKU : PRT-00116), right angle break away headers (PRT-00553), swiss pins (PRT-00743), machine pins (PRT-00117), and female headers (PRT-00115). Molex polarized connector foot print use with SKU : PRT-08231 with associated crimp pins and housings. 1MM SMD Version SKU: PRT-10208
HOST JP1 M_CTS M_RTS USB_PWR = SparkFun:JUMPER-2: Jumper Basic 0.1" spaced jumper. Use with breakaway headers.
I2C1 I2C2 PWR_SW ULTRA_ON = SparkFun:M02: Header 2 Standard 2-pin 0.1" header. Use with straight break away headers (SKU : PRT-00116), right angle break away headers (PRT-00553), swiss pins (PRT-00743), machine pins (PRT-00117), and female headers (PRT-00115). Molex polarized connector foot print use with SKU : PRT-08233 with associated crimp pins and housings.
IC1 IC2 = logic:MAX3002-2
IO_5V_INTERFACE = SparkFun:M06: Header 6 Standard 6-pin 0.1" header. Use with straight break away headers (SKU : PRT-00116), right angle break away headers (PRT-00553), swiss pins (PRT-00743), machine pins (PRT-00117), and female headers (PRT-00115). Molex polarized connector foot print use with SKU : PRT-08094 with associated crimp pins and housings. NOTES ON THE VARIANTS LOCK and LOCK_LONGPADS... This footprint was designed to help hold the alignment of a through-hole component (i.e. 6-pin header) while soldering it into place. You may notice that each hole has been shifted either up or down by 0.005 of an inch from it's more standard position (which is a perfectly straight line). This slight alteration caused the pins (the squares in the middle) to touch the edges of the holes. Because they are alternating, it causes a "brace" to hold the component in place. 0.005 has proven to be the perfect amount of "off-center" position when using our standard breakaway headers. Although looks a little odd when you look at the bare footprint, once you have a header in there, the alteration is very hard to notice. Also, if you push a header all the way into place, it is covered up entirely on the bottom side. This idea of altering the position of holes to aid alignment will be further integrated into the Sparkfun Library for other footprints. It can help hold any component with 3 or more connection pins.
L1 L2 = ind:B82477G
LD1-LD8 = led:LED: LED OSRAM: - CHIPLED LG R971, LG N971, LY N971, LG Q971, LY Q971, LO R971, LY R971 LH N974, LH R974 LS Q976, LO Q976, LY Q976 LO Q996 - Hyper CHIPLED LW Q18S LB Q993, LB Q99A, LB R99A - SideLED LS A670, LO A670, LY A670, LG A670, LP A670 LB A673, LV A673, LT A673, LW A673 LH A674 LY A675 LS A676, LA A676, LO A676, LY A676, LW A676 LS A679, LY A679, LG A679 - Hyper Micro SIDELED® LS Y876, LA Y876, LO Y876, LY Y876 LT Y87S - SmartLED LW L88C, LW L88S LB L89C, LB L89S, LG L890 LS L89K, LO L89K, LY L89K LS L896, LA L896, LO L896, LY L896 - TOPLED LS T670, LO T670, LY T670, LG T670, LP T670 LSG T670, LSP T670, LSY T670, LOP T670, LYG T670 LG T671, LOG T671, LSG T671 LB T673, LV T673, LT T673, LW T673 LH T674 LS T676, LA T676, LO T676, LY T676, LB T676, LH T676, LSB T676, LW T676 LB T67C, LV T67C, LT T67C, LS T67K, LO T67K, LY T67K, LW E67C LS E67B, LA E67B, LO E67B, LY E67B, LB E67C, LV E67C, LT E67C LW T67C LS T679, LY T679, LG T679 LS T770, LO T770, LY T770, LG T770, LP T770 LB T773, LV T773, LT T773, LW T773 LH T774 LS E675, LA E675, LY E675, LS T675 LS T776, LA T776, LO T776, LY T776, LB T776 LHGB T686 LT T68C, LB T68C - Hyper Mini TOPLED® LB M676 - Mini TOPLED Santana® LG M470 LS M47K, LO M47K, LY M47K Source: http://www.osram.convergy.de - LUMILED® LXK2-PW12-R00, LXK2-PW12-S00, LXK2-PW14-U00, LXK2-PW14-V00 LXK2-PM12-R00, LXK2-PM12-S00, LXK2-PM14-U00 LXK2-PE12-Q00, LXK2-PE12-R00, LXK2-PE12-S00, LXK2-PE14-T00, LXK2-PE14-U00 LXK2-PB12-K00, LXK2-PB12-L00, LXK2-PB12-M00, LXK2-PB14-N00, LXK2-PB14-P00, LXK2-PB14-Q00 LXK2-PR12-L00, LXK2-PR12-M00, LXK2-PR14-Q00, LXK2-PR14-R00 LXK2-PD12-Q00, LXK2-PD12-R00, LXK2-PD12-S00 LXK2-PH12-R00, LXK2-PH12-S00 LXK2-PL12-P00, LXK2-PL12-Q00, LXK2-PL12-R00 Source: www.luxeon.com
MCU = mcu:PIC32MX795F512L
MD1 = wifly:WIFLY2
R1-R21 R23-R30 = res:RES0603
REF1 = regulator:REF3133AIDBZTG4
REG1 REG2 = regulator:LM2676
REG3-REG5 = SparkFun:V_REG_LM1117: Voltage Regulator LM1117 Standard adjustable voltage regulator but in SMD form. Spark Fun Electronics SKU : COM-00595
SERVOS = conn:RX_SERVO_STACK
SPI = SparkFun:M05: Header 5 Standard 5-pin 0.1" header. Use with straight break away headers (SKU : PRT-00116), right angle break away headers (PRT-00553), swiss pins (PRT-00743), machine pins (PRT-00117), and female headers (PRT-00115). Molex polarized connector foot print use with SKU : PRT-08230 with associated crimp pins and housings.
SPI_MUX = SparkFun:SOLDERJUMPER_2WAY: Solder Jumper 2 way solder jumper
SWT1-SWT3 = switch:TACT
T1 T2 = mosfet:MOSFET
U1 = SparkFun:USD-SOCKET: microSD Socket Push-push type uSD socket. Schematic element and footprint production proven. Spark Fun Electronics SKU : PRT-00127. tDoc lines correctly indicate media card edge positions when inserting (unlocked, locked, depressed).
U$46 = conn:ICSP
U$47 = conn:USBMINIB2
X2 = crystal:2PIN_RTCC
X3 = crystal:SMD_4PIN_OSC